# EAGLE design POV Schematic (EAGLE 8.2.1)
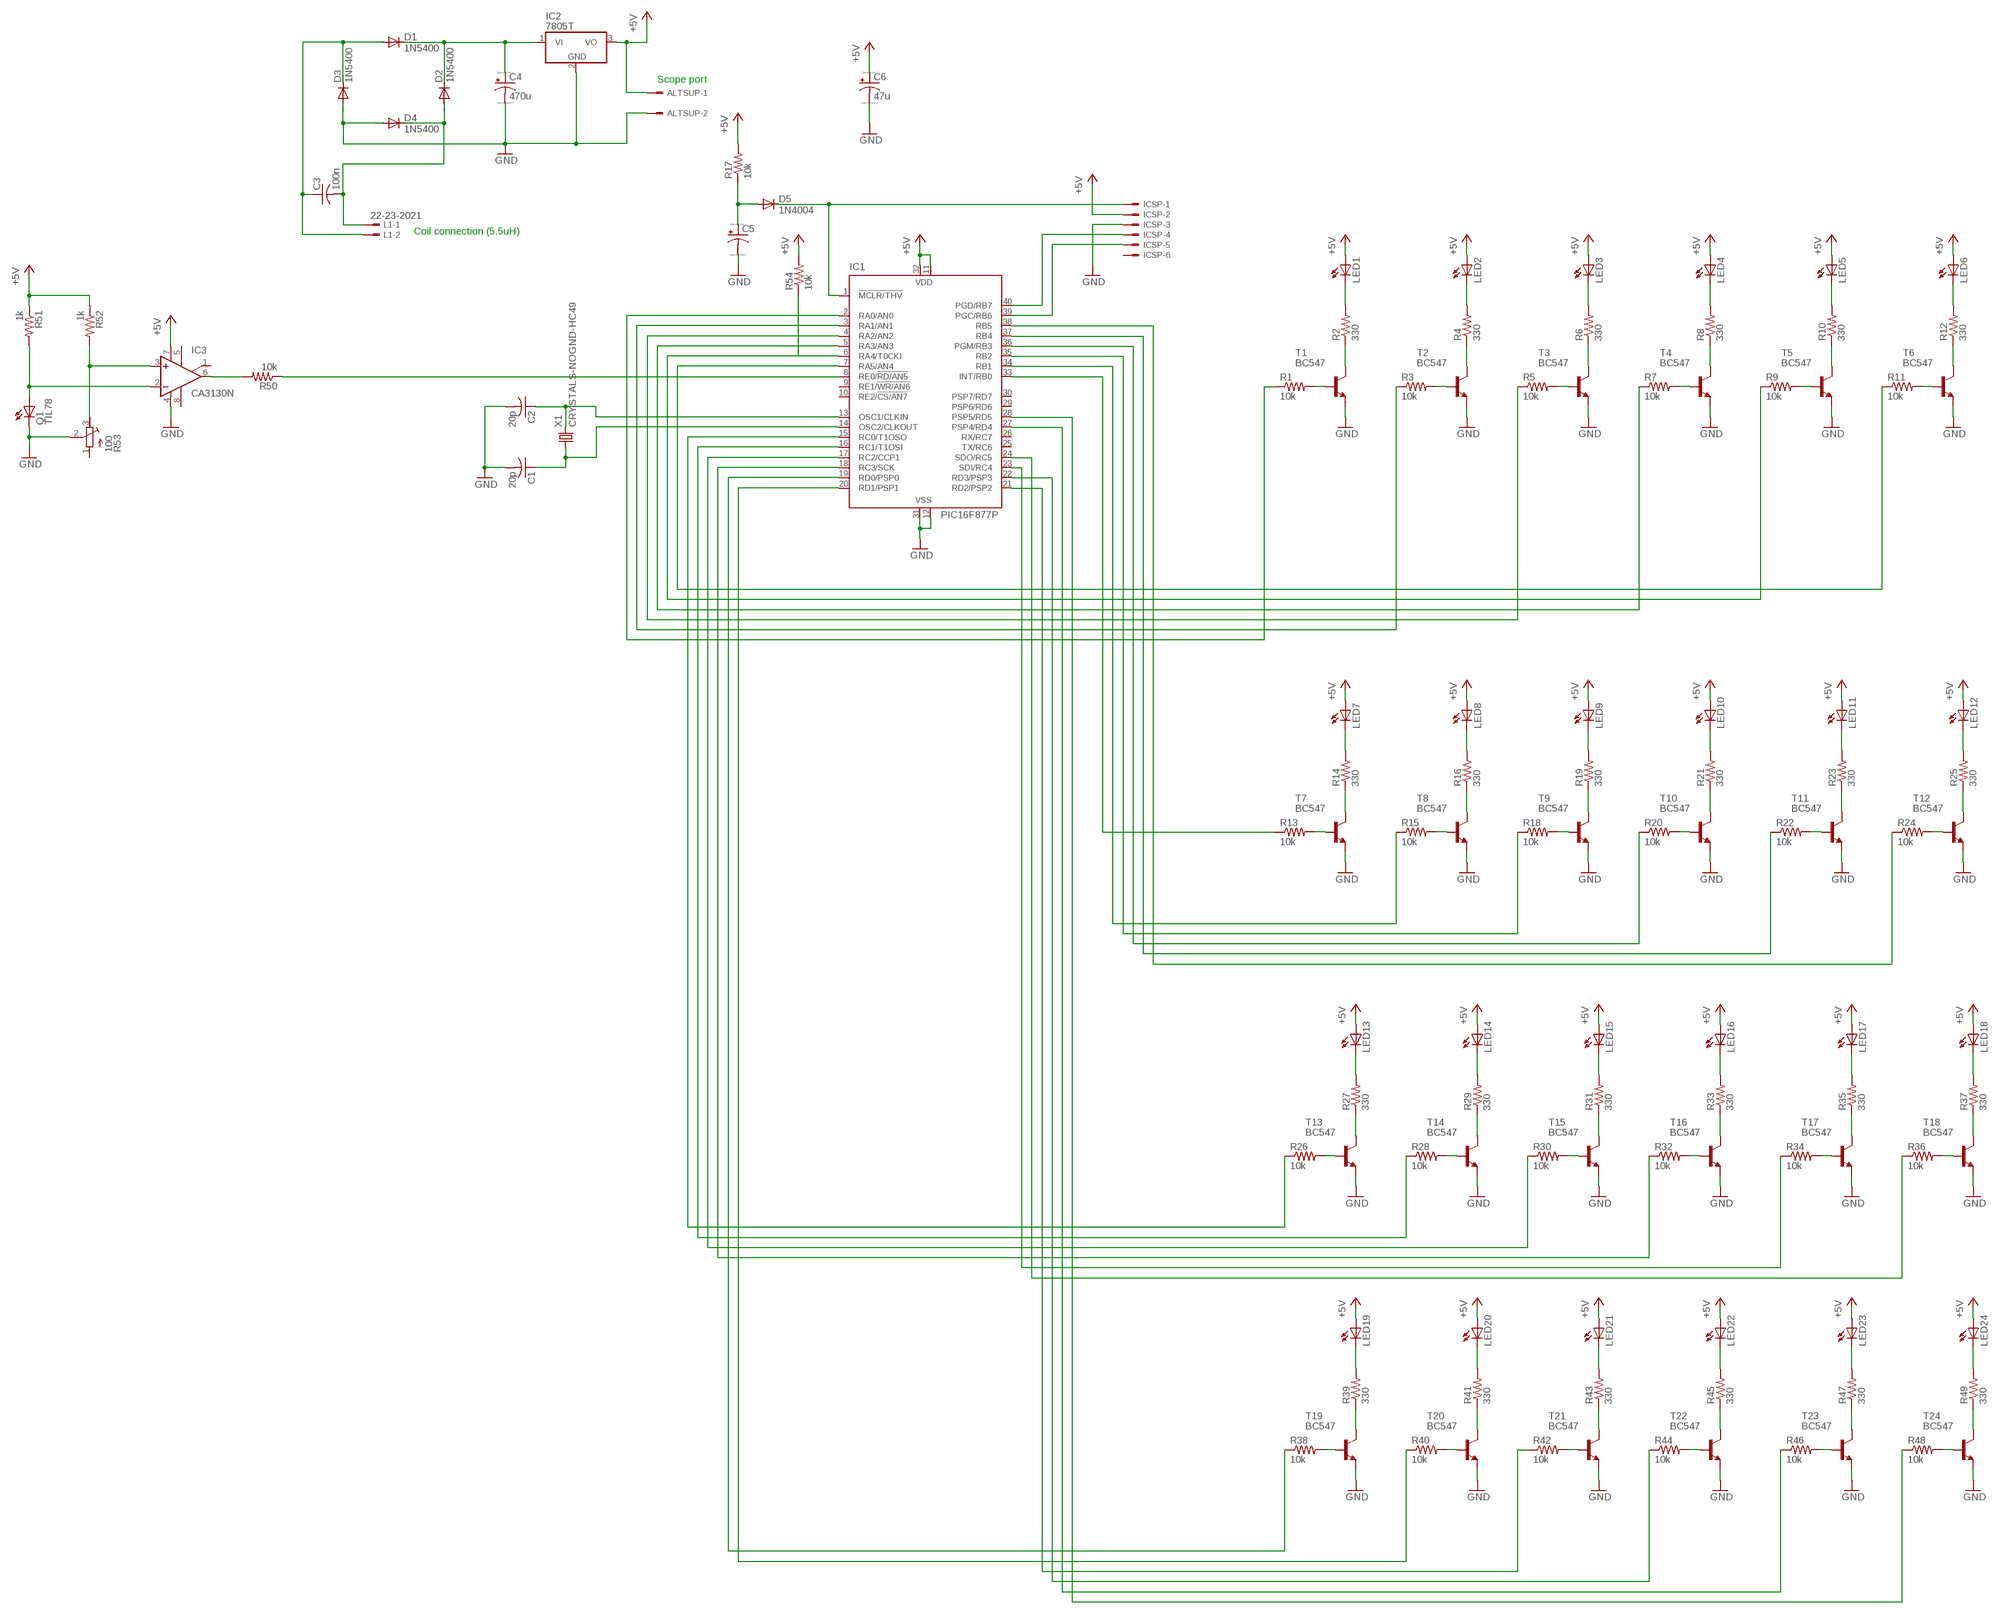
[diagram p0: schematic, sheet 1]

## Parts
ALTSUP  KK-156-2  [KK-156-2]
C1  20p  C-US025-024X044  [C025-024X044]
C2  20p  C-US025-024X044  [C025-024X044]
C3  100n  C-US050-025X075  [C050-025X075]
C4  470u  CPOL-USE3.5-8  [E3,5-8]
C5  CPOL-USE3.5-8  [E3,5-8]
C6  47u  CPOL-USE3.5-8  [E3,5-8]
D1  1N5400  [DO201-15]
D2  1N5400  [DO201-15]
D3  1N5400  [DO201-15]
D4  1N5400  [DO201-15]
D5  1N4004  [DO41-10]
IC1  PIC16F877P  [DIL40]
IC2  7805T  [TO220H]
IC3  CA3130N  [DIL08]
ICSP  KK-156-6  [KK-156-6]
L1  22-23-2021  [22-23-2021]
LED1  LED5MM  [LED5MM]
LED2  LED5MM  [LED5MM]
LED3  LED5MM  [LED5MM]
LED4  LED5MM  [LED5MM]
LED5  LED5MM  [LED5MM]
LED6  LED5MM  [LED5MM]
LED7  LED5MM  [LED5MM]
LED8  LED5MM  [LED5MM]
LED9  LED5MM  [LED5MM]
LED10  LED5MM  [LED5MM]
LED11  LED5MM  [LED5MM]
LED12  LED5MM  [LED5MM]
LED13  LED5MM  [LED5MM]
LED14  LED5MM  [LED5MM]
LED15  LED5MM  [LED5MM]
LED16  LED5MM  [LED5MM]
LED17  LED5MM  [LED5MM]
LED18  LED5MM  [LED5MM]
LED19  LED5MM  [LED5MM]
LED20  LED5MM  [LED5MM]
LED21  LED5MM  [LED5MM]
LED22  LED5MM  [LED5MM]
LED23  LED5MM  [LED5MM]
LED24  LED5MM  [LED5MM]
Q1  TIL78  LED5MM  [LED5MM]
R1  10k  R-US_0204/2V  [0204V]
R2  330  R-US_0204/2V  [0204V]
R3  10k  R-US_0204/2V  [0204V]
R4  330  R-US_0204/2V  [0204V]
R5  10k  R-US_0204/2V  [0204V]
R6  330  R-US_0204/2V  [0204V]
R7  10k  R-US_0204/2V  [0204V]
R8  330  R-US_0204/2V  [0204V]
R9  10k  R-US_0204/2V  [0204V]
R10  330  R-US_0204/2V  [0204V]
R11  10k  R-US_0204/2V  [0204V]
R12  330  R-US_0204/2V  [0204V]
R13  10k  R-US_0204/2V  [0204V]
R14  330  R-US_0204/2V  [0204V]
R15  10k  R-US_0204/2V  [0204V]
R16  330  R-US_0204/2V  [0204V]
R17  10k  R-US_0204/2V  [0204V]
R18  10k  R-US_0204/2V  [0204V]
R19  330  R-US_0204/2V  [0204V]
R20  10k  R-US_0204/2V  [0204V]
R21  330  R-US_0204/2V  [0204V]
R22  10k  R-US_0204/2V  [0204V]
R23  330  R-US_0204/2V  [0204V]
R24  10k  R-US_0204/2V  [0204V]
R25  330  R-US_0204/2V  [0204V]
R26  10k  R-US_0204/2V  [0204V]
R27  330  R-US_0204/2V  [0204V]
R28  10k  R-US_0204/2V  [0204V]
R29  330  R-US_0204/2V  [0204V]
R30  10k  R-US_0204/2V  [0204V]
R31  330  R-US_0204/2V  [0204V]
R32  10k  R-US_0204/2V  [0204V]
R33  330  R-US_0204/2V  [0204V]
R34  10k  R-US_0204/2V  [0204V]
R35  330  R-US_0204/2V  [0204V]
R36  10k  R-US_0204/2V  [0204V]
R37  330  R-US_0204/2V  [0204V]
R38  10k  R-US_0204/2V  [0204V]
R39  330  R-US_0204/2V  [0204V]
R40  10k  R-US_0204/2V  [0204V]
R41  330  R-US_0204/2V  [0204V]
R42  10k  R-US_0204/2V  [0204V]
R43  330  R-US_0204/2V  [0204V]
R44  10k  R-US_0204/2V  [0204V]
R45  330  R-US_0204/2V  [0204V]
R46  10k  R-US_0204/2V  [0204V]
R47  330  R-US_0204/2V  [0204V]
R48  10k  R-US_0204/2V  [0204V]
R49  330  R-US_0204/2V  [0204V]
R50  10k  R-US_0204/2V  [0204V]
R51  1k  R-US_0204/2V  [0204V]
R52  1k  R-US_0204/2V  [0204V]
R53  100  R-TRIMM3296W  [RTRIM3296W]
R54  10k  R-US_0204/2V  [0204V]
T1  BC547  [TO92]
T2  BC547  [TO92]
T3  BC547  [TO92]
T4  BC547  [TO92]
T5  BC547  [TO92]
T6  BC547  [TO92]
T7  BC547  [TO92]
T8  BC547  [TO92]
T9  BC547  [TO92]
T10  BC547  [TO92]
T11  BC547  [TO92]
T12  BC547  [TO92]
T13  BC547  [TO92]
T14  BC547  [TO92]
T15  BC547  [TO92]
T16  BC547  [TO92]
T17  BC547  [TO92]
T18  BC547  [TO92]
T19  BC547  [TO92]
T20  BC547  [TO92]
T21  BC547  [TO92]
T22  BC547  [TO92]
T23  BC547  [TO92]
T24  BC547  [TO92]
X1  CRYSTALS-NOGND-HC49  [HC49]

## Nets
+5V: ALTSUP.1 C6.+ IC1.11(VDD) IC1.32(VDD) IC2.3(VO) IC3.7(V+) ICSP.2 LED1.A LED2.A LED3.A LED4.A LED5.A LED6.A LED7.A LED8.A LED9.A LED10.A LED11.A LED12.A LED13.A LED14.A LED15.A LED16.A LED17.A LED18.A LED19.A LED20.A LED21.A LED22.A LED23.A LED24.A R17.2 R51.1 R52.1 R54.2
GND: ALTSUP.2 C1.2 C2.2 C4.- C5.- C6.- D3.A D4.A IC1.12(VSS) IC1.31(VSS) IC2.2(GND) IC3.4(V-) ICSP.3 Q1.K(C) R53.2(S) T1.1(E) T2.1(E) T3.1(E) T4.1(E) T5.1(E) T6.1(E) T7.1(E) T8.1(E) T9.1(E) T10.1(E) T11.1(E) T12.1(E) T13.1(E) T14.1(E) T15.1(E) T16.1(E) T17.1(E) T18.1(E) T19.1(E) T20.1(E) T21.1(E) T22.1(E) T23.1(E) T24.1(E)
N$1: C3.2 D2.A D4.C L1.1
N$2: C3.1 D1.A D3.C L1.2
N$3: D5.C IC1.1(!MCLR/THV) ICSP.1
N$4: C5.+ D5.A R17.1
N$5: C2.1 IC1.13(OSC1/CLKIN) X1.2
N$6: C4.+ D1.C D2.C IC2.1(VI)
N$7: C1.1 IC1.14(OSC2/CLKOUT) X1.1
N$8: R2.1 T1.3(C)
N$9: LED1.K(C) R2.2
N$10: R1.2 T1.2(B)
N$11: R4.1 T2.3(C)
N$12: LED2.K(C) R4.2
N$13: R3.2 T2.2(B)
N$14: R6.1 T3.3(C)
N$15: LED3.K(C) R6.2
N$16: R5.2 T3.2(B)
N$17: R8.1 T4.3(C)
N$18: LED4.K(C) R8.2
N$19: R7.2 T4.2(B)
N$20: R10.1 T5.3(C)
N$21: LED5.K(C) R10.2
N$22: R9.2 T5.2(B)
N$23: R12.1 T6.3(C)
N$24: LED6.K(C) R12.2
N$25: R11.2 T6.2(B)
N$26: R14.1 T7.3(C)
N$27: LED7.K(C) R14.2
N$28: R13.2 T7.2(B)
N$29: R16.1 T8.3(C)
N$30: LED8.K(C) R16.2
N$31: R15.2 T8.2(B)
N$32: R39.1 T19.3(C)
N$33: IC1.40(PGD/RB7) ICSP.4
N$34: IC1.39(PGC/RB6) ICSP.5
N$35: IC1.2(RA0/AN0) R1.1
N$36: IC1.3(RA1/AN1) R3.1
N$37: IC1.4(RA2/AN2) R5.1
N$38: IC1.5(RA3/AN3) R7.1
N$39: R9.1
N$40: IC1.7(RA5/AN4) R11.1
N$41: R19.1 T9.3(C)
N$42: LED9.K(C) R19.2
N$43: R18.2 T9.2(B)
N$44: R21.1 T10.3(C)
N$45: LED10.K(C) R21.2
N$46: R20.2 T10.2(B)
N$47: R23.1 T11.3(C)
N$48: LED11.K(C) R23.2
N$49: R22.2 T11.2(B)
N$50: R25.1 T12.3(C)
N$51: LED12.K(C) R25.2
N$52: R24.2 T12.2(B)
N$53: IC1.33(INT/RB0) R13.1
N$54: IC1.34(RB1) R15.1
N$55: IC1.35(RB2) R18.1
N$56: IC1.36(PGM/RB3) R20.1
N$57: IC1.37(RB4) R22.1
N$58: IC1.38(RB5) R24.1
N$59: R27.1 T13.3(C)
N$60: LED13.K(C) R27.2
N$61: R26.2 T13.2(B)
N$62: R29.1 T14.3(C)
N$63: LED14.K(C) R29.2
N$64: R28.2 T14.2(B)
N$65: R31.1 T15.3(C)
N$66: LED15.K(C) R31.2
N$67: R30.2 T15.2(B)
N$68: R33.1 T16.3(C)
N$69: LED16.K(C) R33.2
N$70: R32.2 T16.2(B)
N$71: R35.1 T17.3(C)
N$72: LED17.K(C) R35.2
N$73: R34.2 T17.2(B)
N$74: R37.1 T18.3(C)
N$75: LED18.K(C) R37.2
N$76: R36.2 T18.2(B)
N$77: LED19.K(C) R39.2
N$78: R38.2 T19.2(B)
N$79: R41.1 T20.3(C)
N$80: LED20.K(C) R41.2
N$81: R40.2 T20.2(B)
N$82: R43.1 T21.3(C)
N$83: LED21.K(C) R43.2
N$84: R42.2 T21.2(B)
N$85: R45.1 T22.3(C)
N$86: LED22.K(C) R45.2
N$87: R44.2 T22.2(B)
N$88: R47.1 T23.3(C)
N$89: LED23.K(C) R47.2
N$90: R46.2 T23.2(B)
N$91: R49.1 T24.3(C)
N$92: LED24.K(C) R49.2
N$93: R48.2 T24.2(B)
N$94: IC1.15(RC0/T1OSO) R26.1
N$95: IC1.16(RC1/T1OSI) R28.1
N$96: IC1.17(RC2/CCP1) R30.1
N$97: IC1.18(RC3/SCK) R32.1
N$98: IC1.23(SDI/RC4) R34.1
N$99: IC1.24(SDO/RC5) R36.1
N$100: IC1.19(RD0/PSP0) R38.1
N$101: IC1.20(RD1/PSP1) R40.1
N$102: IC1.21(RD2/PSP2) R42.1
N$103: IC1.22(RD3/PSP3) R44.1
N$104: IC1.27(PSP4/RD4) R46.1
N$105: IC1.28(PSP5/RD5) R48.1
N$106: IC3.2(-IN) Q1.A R51.2
N$107: IC3.6(OUT) R50.2
N$108: IC1.8(RE0/!RD/AN5) R50.1
N$109: IC3.3(+IN) R52.2 R53.3(E)
N$110: IC1.6(RA4/T0CKI) R54.1
Unconnected: IC1.9(RE1/!WR/AN6) IC1.10(RE2/!CS/AN7) IC1.25(TX/RC6) IC1.26(RX/RC7) IC1.29(PSP6/RD6) IC1.30(PSP7/RD7) IC3.1(ON/CMP) IC3.5(ON) IC3.8(CMP) ICSP.6 R53.1(A)

## Notes on the sheet
- Scope port
- Coil connection (5.5uH)

## Library data of the parts
ALTSUP = con-molex:KK-156-2: KK 156 HEADER Source: http://www.molex.com/pdm_docs/sd/026604100_sd.pdf; OC_FARNELL: unknown; OC_NEWARK: unknown
C1 C2 = resistor:C-US: CAPACITOR, American symbol
C3 = rcl:C-US: CAPACITOR, American symbol
C4-C6 = resistor:CPOL-US: POLARIZED CAPACITOR, American symbol
D1-D4 = diode:1N5400: DIODE standard rectifier, 3 A, 50 V (Motorola)
D5 = diode:1N4004: DIODE general purpose rectifier, 1 A
IC1 = microchip:PIC16F87*: MICROCONTROLLER; MF: MICROCHIP; MPN: PIC16F877-04/P; OC_FARNELL: 9761349; OC_NEWARK: 61K3463
IC2 = linear:78*: Positive VOLTAGE REGULATOR Source: http://cache.national.com/ds/LM/LM78L05.pdf http://www.fairchildsemi.com/ds/LM/LM7805.pdf
IC3 = linear:CA3130: OP AMP
ICSP = con-molex:KK-156-6: KK 156 HEADER Source: http://www.molex.com/pdm_docs/sd/026604100_sd.pdf; OC_FARNELL: unknown; OC_NEWARK: unknown
L1 = con-molex:22-23-2021: .100" (2.54mm) Center Header - 2 Pin; MF: MOLEX; MPN: 22-23-2021; OC_FARNELL: 1462926; OC_NEWARK: 25C3832
LED1-LED24 Q1 = led:LED: LED OSRAM: - CHIPLED LG R971, LG N971, LY N971, LG Q971, LY Q971, LO R971, LY R971 LH N974, LH R974 LS Q976, LO Q976, LY Q976 LO Q996 - Hyper CHIPLED LW Q18S LB Q993, LB Q99A, LB R99A - SideLED LS A670, LO A670, LY A670, LG A670, LP A670 LB A673, LV A673, LT A673, LW A673 LH A674 LY A675 LS A676, LA A676, LO A676, LY A676, LW A676 LS A679, LY A679, LG A679 - Hyper Micro SIDELED® LS Y876, LA Y876, LO Y876, LY Y876 LT Y87S - SmartLED LW L88C, LW L88S LB L89C, LB L89S, LG L890 LS L89K, LO L89K, LY L89K LS L896, LA L896, LO L896, LY L896 - TOPLED LS T670, LO T670, LY T670, LG T670, LP T670 LSG T670, LSP T670, LSY T670, LOP T670, LYG T670 LG T671, LOG T671, LSG T671 LB T673, LV T673, LT T673, LW T673 LH T674 LS T676, LA T676, LO T676, LY T676, LB T676, LH T676, LSB T676, LW T676 LB T67C, LV T67C, LT T67C, LS T67K, LO T67K, LY T67K, LW E67C LS E67B, LA E67B, LO E67B, LY E67B, LB E67C, LV E67C, LT E67C LW T67C LS T679, LY T679, LG T679 LS T770, LO T770, LY T770, LG T770, LP T770 LB T773, LV T773, LT T773, LW T773 LH T774 LS E675, LA E675, LY E675, LS T675 LS T776, LA T776, LO T776, LY T776, LB T776 LHGB T686 LT T68C, LB T68C - Hyper Mini TOPLED® LB M676 - Mini TOPLED Santana® LG M470 LS M47K, LO M47K, LY M47K Source: http://www.osram.convergy.de LUXEON: - LUMILED® LXK2-PW12-R00, LXK2-PW12-S00, LXK2-PW14-U00, LXK2-PW14-V00 LXK2-PM12-R00, LXK2-PM12-S00, LXK2-PM14-U00 LXK2-PE12-Q00, LXK2-PE12-R00, LXK2-PE12-S00, LXK2-PE14-T00, LXK2-PE14-U00 LXK2-PB12-K00, LXK2-PB12-L00, LXK2-PB12-M00, LXK2-PB14-N00, LXK2-PB14-P00, LXK2-PB14-Q00 LXK2-PR12-L00, LXK2-PR12-M00, LXK2-PR14-Q00, LXK2-PR14-R00 LXK2-PD12-Q00, LXK2-PD12-R00, LXK2-PD12-S00 LXK2-PH12-R00, LXK2-PH12-S00 LXK2-PL12-P00, LXK2-PL12-Q00, LXK2-PL12-R00 Source: www.luxeon.com KINGBRIGHT: KA-3528ASYC Source: www.kingbright.com
R1-R52 R54 = resistor:R-US_: RESISTOR, American symbol
R53 = rcl:R-TRIMM: Trimm resistor
T1-T24 = transistor:BC547: NPN TRANSISTOR
X1 = IQD-Frequency-Products:CRYSTALS-NOGND: CRYSTALS CAN NOT GROUNDED

## Net classes
0 default: width 0.254 mm

## Board
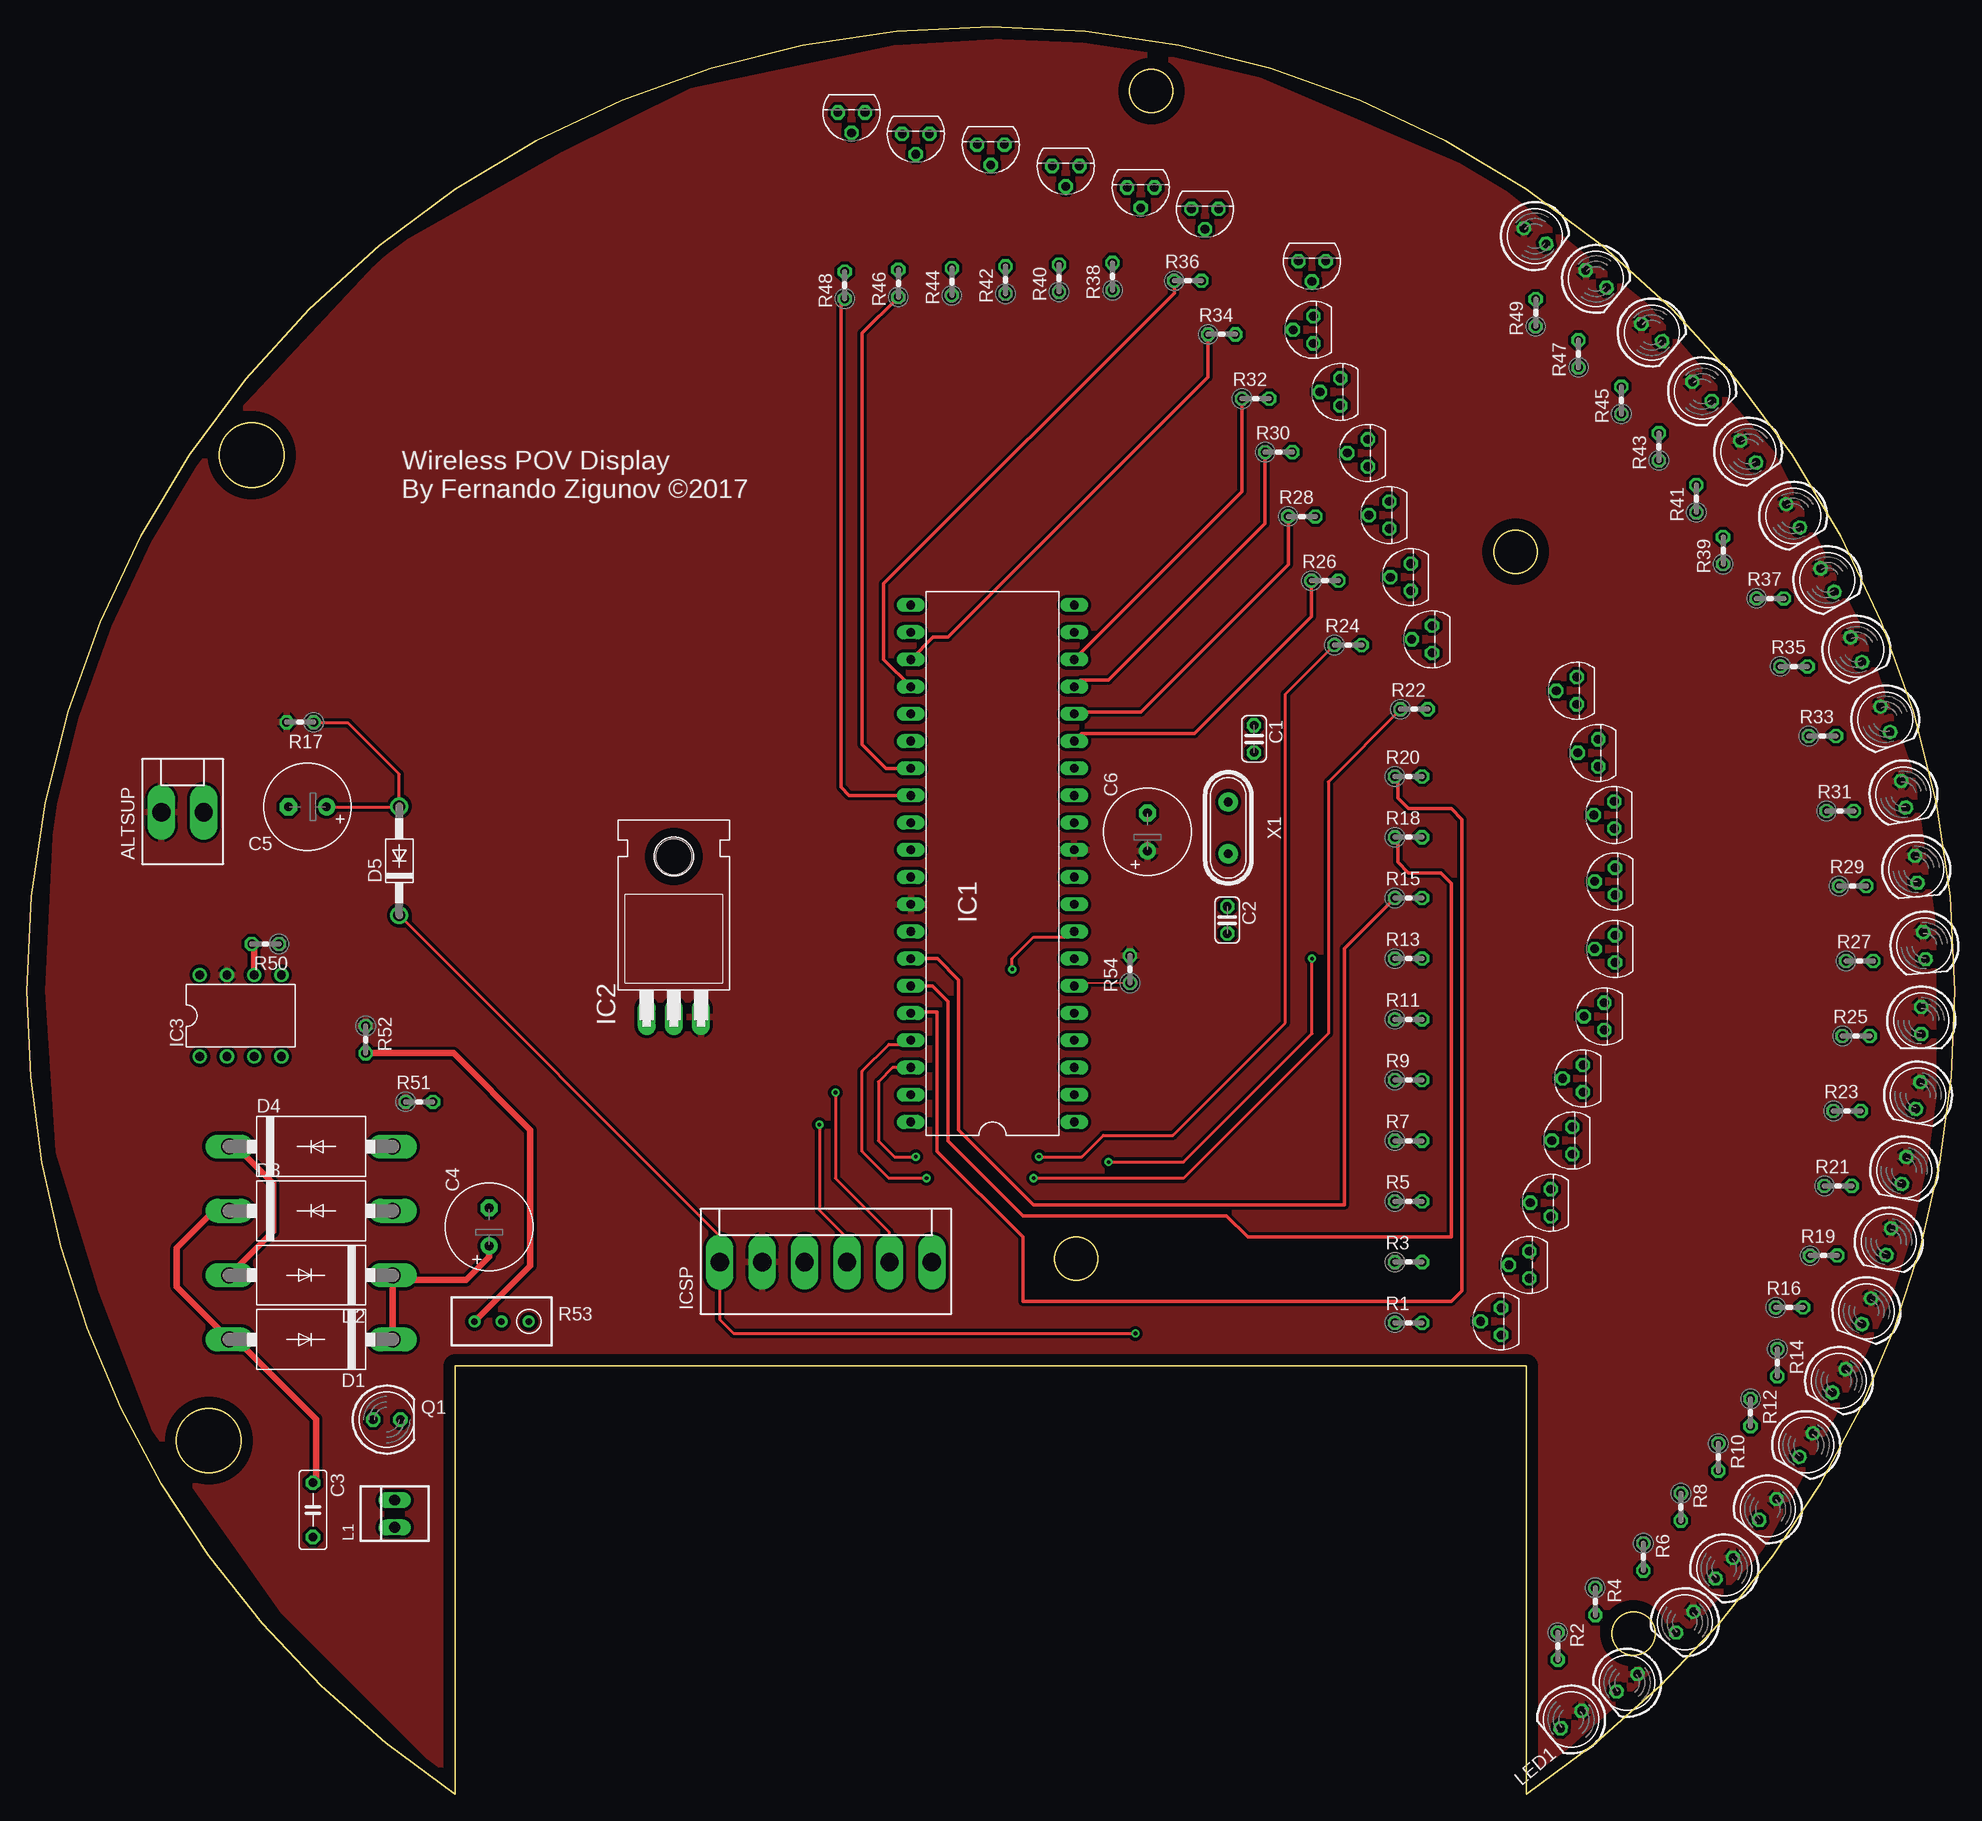
[diagram p1: board, top side]
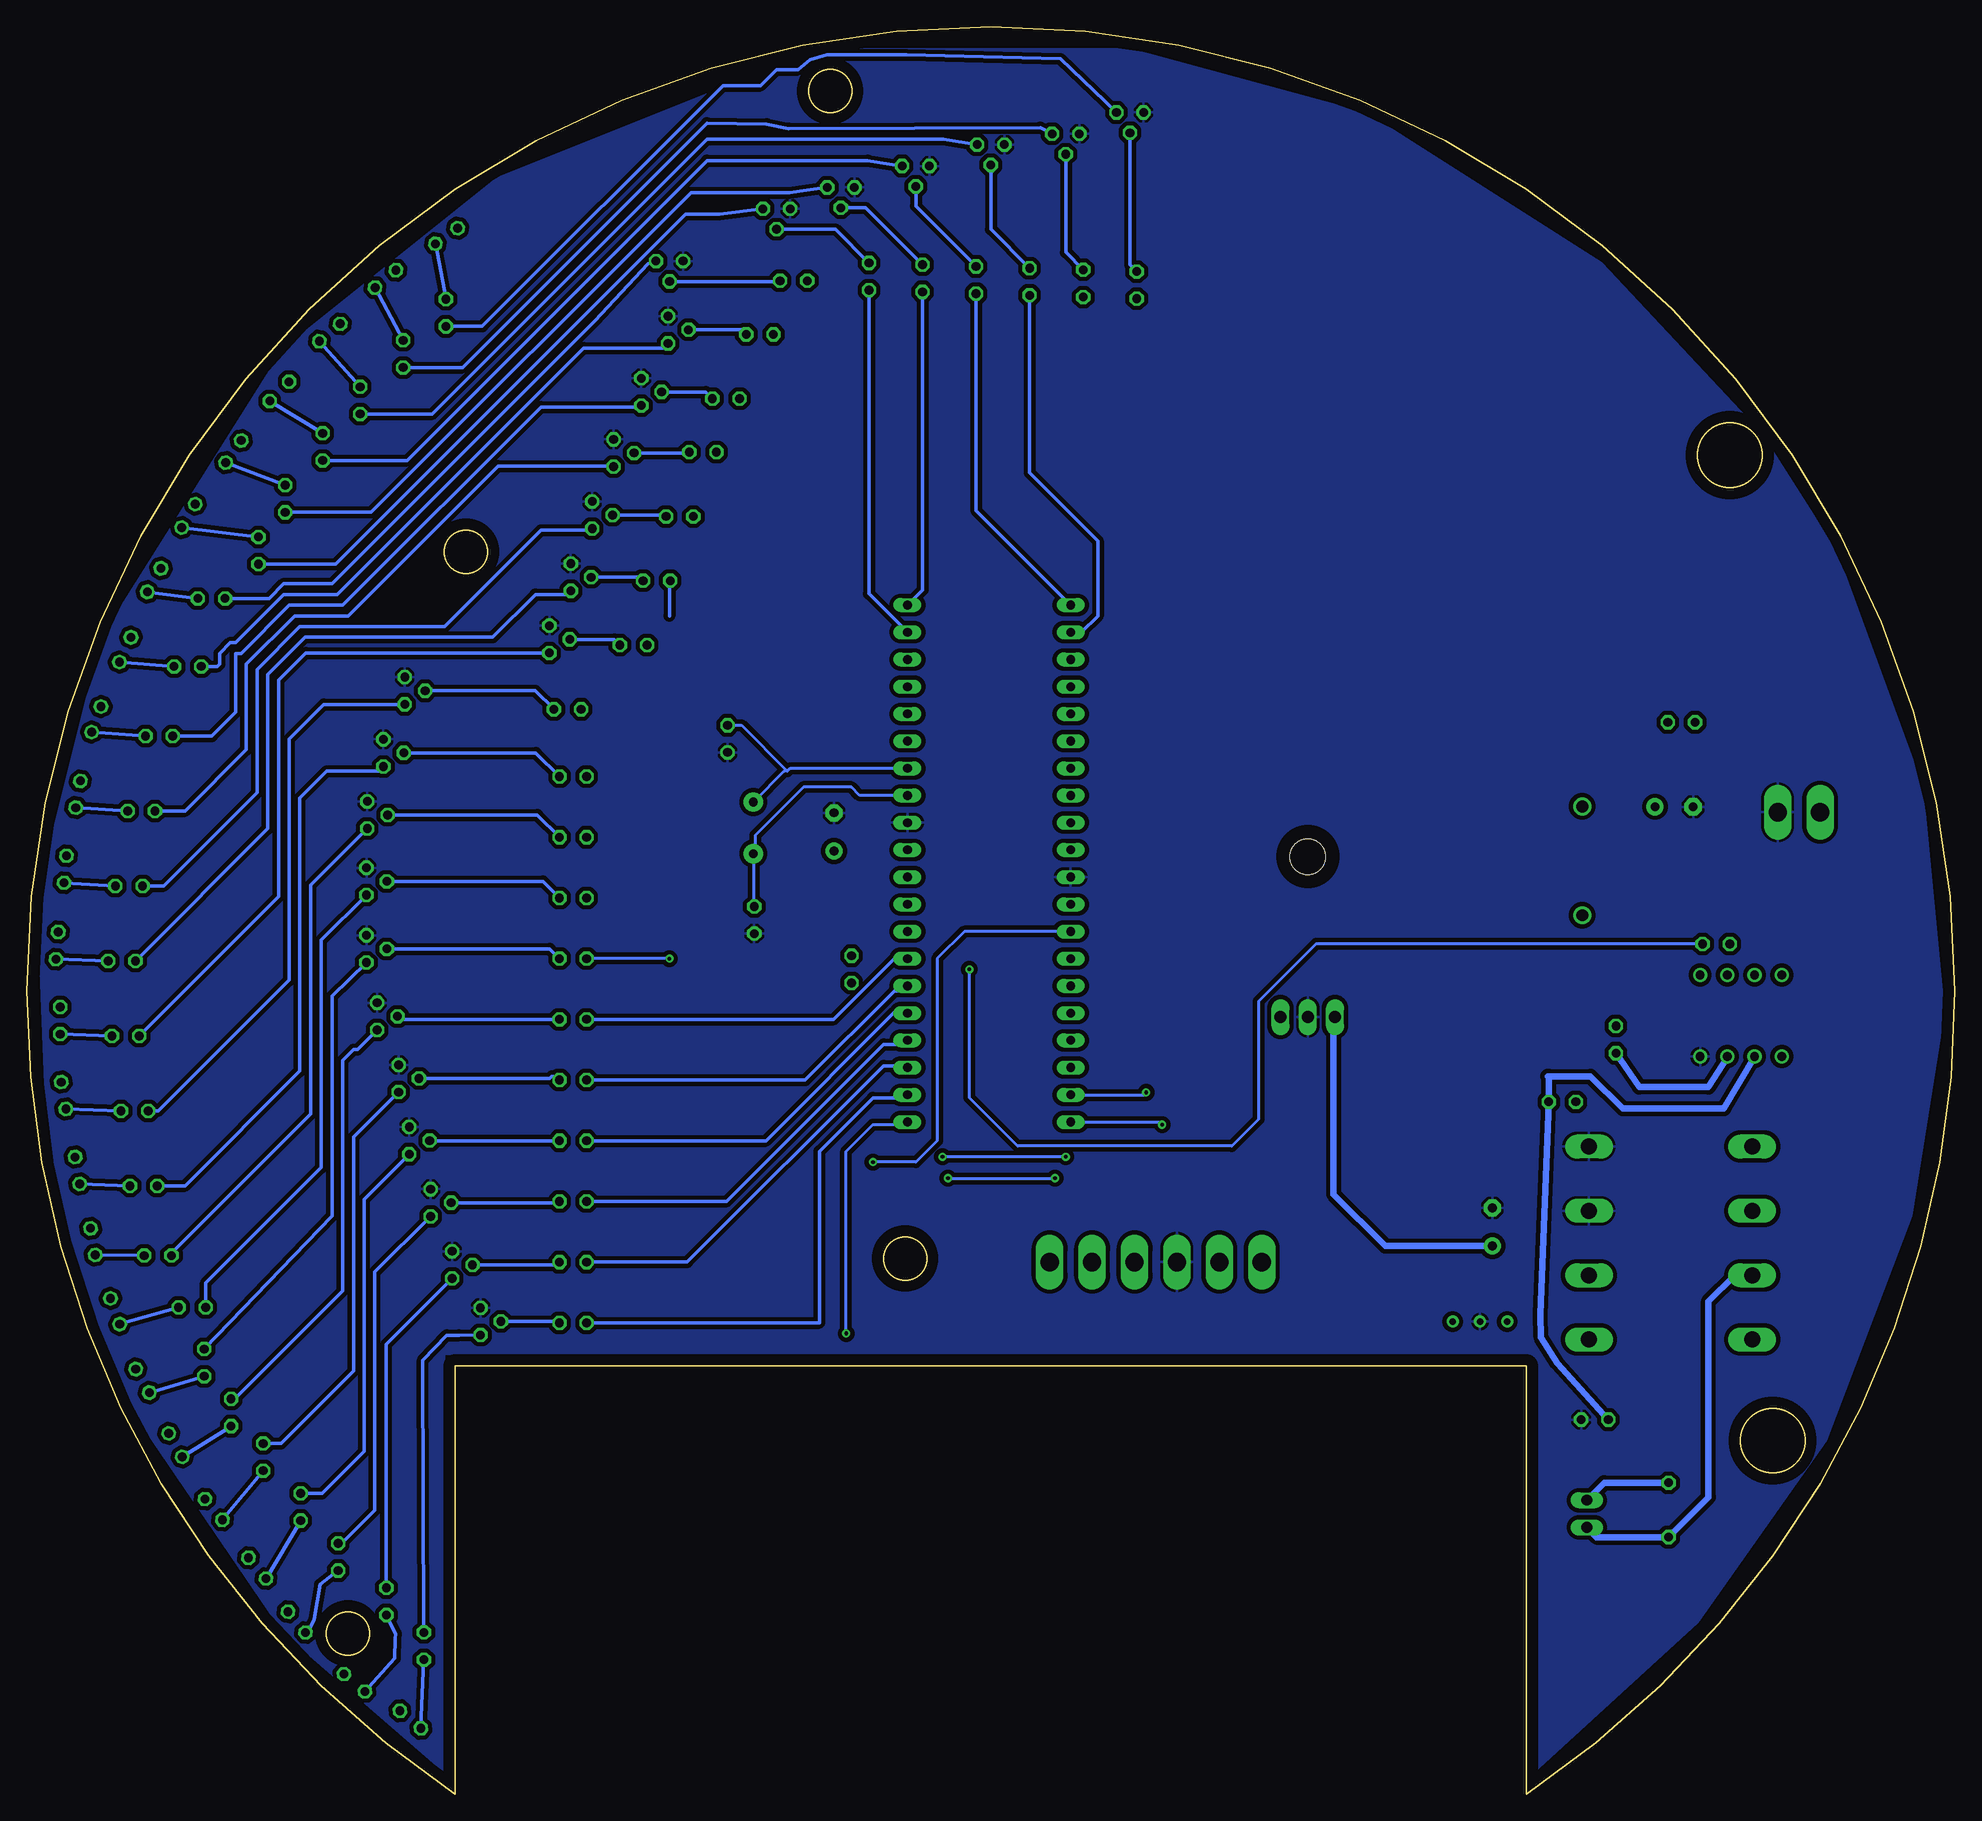
[diagram p2: board, bottom side, seen from below]

Size 180 x 165 mm. Coordinates in mm from the lower left corner, seen from the top.
Outline: 140,40 140,0 arc56 180,75 arc180 0,75 arc56 40,0 40,40 140,40
Outline: circle at 17,33 radius 3
Outline: circle at 21,125 radius 3
Outline: circle at 98,50 radius 2
Outline: circle at 150,15 radius 2
Outline: circle at 139,116 radius 2
Outline: circle at 105,159 radius 2
Copper layers (1*16): Top 0.035mm / dielectric 1.5mm / Bottom 0.035mm
Design rules "default *": minimum track width 6mil, minimum drill 0.35mm, track to track 6mil, track to pad 6mil, pad to pad 6mil, via to via 6mil, smd to smd 6mil, copper to edge 40mil, drill to drill 10mil, minimum pad ring 10mil, minimum via ring 8mil, stop-mask expansion 4mil, vias tented up to drill 0mil, thermal gap 10mil

### Footprints (pad centres in the part's own frame; a part is rotated, then mirrored left to right if it is on the bottom)
KK-156-2 = drill 1.7 pad 2.184 long: 1 -1.98,0; 2 1.98,0
C025-024X044 = drill 0.813 octagon: 1 -1.27,0; 2 1.27,0
C050-025X075 = drill 0.813 octagon: 1 -2.54,0; 2 2.54,0
E3,5-8 = drill 0.813 pad 1.6: + -1.778,0 | drill 0.813 pad 1.6 octagon: - 1.778,0
DO201-15 = drill 1.499 long: A 7.62,0; C -7.62,0
DO41-10 = drill 1.118: A 5.08,0; C -5.08,0
DIL40 = drill 0.813 long: 1 -24.13,-7.62; 2 -21.59,-7.62; 3 -19.05,-7.62; 4 -16.51,-7.62; 5 -13.97,-7.62; 6 -11.43,-7.62; 7 -8.89,-7.62; 8 -6.35,-7.62; 9 -3.81,-7.62; 10 -1.27,-7.62; 11 1.27,-7.62; 12 3.81,-7.62; 13 6.35,-7.62; 14 8.89,-7.62; 15 11.43,-7.62; 16 13.97,-7.62; 17 16.51,-7.62; 18 19.05,-7.62; 19 21.59,-7.62; 20 24.13,-7.62; 21 24.13,7.62; 22 21.59,7.62; 23 19.05,7.62; 24 16.51,7.62; 25 13.97,7.62; 26 11.43,7.62; 27 8.89,7.62; 28 6.35,7.62; 29 3.81,7.62; 30 1.27,7.62; 31 -1.27,7.62; 32 -3.81,7.62; 33 -6.35,7.62; 34 -8.89,7.62; 35 -11.43,7.62; 36 -13.97,7.62; 37 -16.51,7.62; 38 -19.05,7.62; 39 -21.59,7.62; 40 -24.13,7.62
TO220H = drill 1.118 long: 1 -2.54,-10.16; 2 0,-10.16; 3 2.54,-10.16 | hole 3.302: 0,4.826
DIL08 = drill 0.813 pad 1.27: 1 -3.81,-3.81; 2 -1.27,-3.81; 3 1.27,-3.81; 4 3.81,-3.81; 5 3.81,3.81; 6 1.27,3.81; 7 -1.27,3.81; 8 -3.81,3.81
KK-156-6 = drill 1.7 pad 2.184 long: 1 -9.9,0; 2 -5.94,0; 3 -1.98,0; 4 1.98,0; 5 5.94,0; 6 9.9,0
22-23-2021 = drill 1 long: 1 -1.27,0; 2 1.27,0
LED5MM = drill 0.813 octagon: A -1.27,0; K 1.27,0
0204V = drill 0.813 octagon: 1 -1.27,0; 2 1.27,0
RTRIM3296W = drill 0.61: 1 0,-2.54; 2 0,0; 3 0,2.54
TO92 = drill 0.813 octagon: 1 1.27,0; 2 0,1.905; 3 -1.27,0
HC49 = drill 0.813 pad 1.8: 1 -2.413,0; 2 2.413,0

### Placement (x,y rotation side)
ALTSUP  14.55,91.67 0 top
C1  114.58,98.52 270 top
C2  112.08,81.6 270 top
C3  26.72,26.53 270 top
C4  43.17,52.95 90 top
C5  26.21,92.17 180 top
C6  104.63,89.83 90 top
D1  26.53,42.44 180 top
D2  26.53,48.44 180 top
D3  26.53,54.45 0 top
D4  26.53,60.45 0 top
D5  34.78,87.13 90 top
IC1  90.16,86.88 90 top
IC2  60.41,82.7 0 top
IC3  19.96,72.67 0 top
ICSP  74.6,49.67 0 top
L1  34.35,26.17 90 top
LED1  144.18,6.96 220 top
LED2  149.41,10.39 220 top
LED3  154.79,16.05 230 top
LED4  158.48,21.08 230 top
LED5  162.55,26.58 230 top
LED6  166.12,32.58 240 top
LED7  169.19,38.58 240 top
LED8  171.76,45.08 250 top
LED9  173.83,51.58 260 top
LED10  175.27,58.22 260 top
LED11  176.57,65.22 260 top
LED12  176.87,72.22 270 top
LED13  177.17,79.22 275 top
LED14  176.41,86.34 275 top
LED15  175.21,93.34 280 top
LED16  173.51,100.34 290 top
LED17  170.81,106.84 295 top
LED18  168.11,113.34 300 top
LED19  164.91,119.34 300 top
LED20  160.71,125.34 305 top
LED21  156.41,130.96 315 top
LED22  151.71,136.46 320 top
LED23  146.51,141.46 320 top
LED24  140.81,145.46 325 top
Q1  33.61,34.96 0 top
R1  129,44 0 top
R2  142.93,13.82 270 top
R3  129,49.67 0 top
R4  146.43,17.98 270 top
R5  129,55.33 0 top
R6  150.93,22.14 270 top
R7  129,61 0 top
R8  154.43,26.8 270 top
R9  129,66.67 0 top
R10  157.93,31.46 270 top
R11  129,72.33 0 top
R12  160.93,35.62 270 top
R13  129,78 0 top
R14  163.43,40.28 270 top
R15  129,83.67 0 top
R16  164.56,45.43 0 top
R17  25.52,100.07 180 top
R18  129,89.33 0 top
R19  167.76,50.28 0 top
R20  129,95 0 top
R21  169.1,56.78 0 top
R22  129.52,101.28 0 top
R23  169.94,63.78 0 top
R24  123.36,107.28 0 top
R25  170.78,70.78 0 top
R26  121.2,113.28 0 top
R27  171.12,77.78 0 top
R28  119.04,119.28 0 top
R29  170.46,84.78 0 top
R30  116.88,125.28 0 top
R31  169.3,91.78 0 top
R32  114.72,130.28 0 top
R33  167.64,98.78 0 top
R34  111.56,136.28 0 top
R35  164.98,105.28 0 top
R36  108.4,141.28 0 top
R37  162.76,111.63 0 top
R38  101.37,141.68 90 top
R39  158.37,116.1 90 top
R40  96.37,141.52 90 top
R41  155.87,120.94 90 top
R42  91.37,141.36 90 top
R43  152.37,125.78 90 top
R44  86.37,141.2 90 top
R45  148.87,130.12 90 top
R46  81.37,141.04 90 top
R47  144.87,134.46 90 top
R48  76.37,140.88 90 top
R49  140.87,138.3 90 top
R50  22.28,79.37 180 top
R51  36.64,64.63 0 top
R52  31.63,70.44 270 top
R53  44.33,44.12 90 top
R54  103,77 90 top
T1  137.64,44.13 90 top
T2  140.29,49.41 90 top
T3  142.29,55.21 90 top
T4  144.29,61.01 90 top
T5  145.29,66.81 90 top
T6  147.29,72.61 90 top
T7  148.29,78.91 90 top
T8  148.29,85.21 90 top
T9  148.21,91.41 90 top
T10  146.71,97.21 90 top
T11  144.71,103.01 90 top
T12  131.21,107.81 90 top
T13  129.21,113.61 90 top
T14  127.21,119.41 90 top
T15  125.21,125.21 90 top
T16  122.63,130.91 90 top
T17  120.13,136.71 90 top
T18  119.99,143.13 180 top
T19  110,148 180 top
T20  104,150 180 top
T21  97,152 180 top
T22  90,154 180 top
T23  83,155 180 top
T24  77,157 180 top
X1  112.17,90.21 270 top

### Tracks (layer width: path | path; a pad name or v marks a point on that pad's centre or on a via)
+5V
  pour Top (isolate 0.3): 39,2 39,41 141,41 141,2 150,10 162,23 170,38 176,51 178,64 178,81 176,95 171,109 163,125 151,139 136,151 115,160 98,164 81,163 62,159 50,153 34,144 20,129 11,117 3,95 2,75 3,60 7,47 12,34 24,17
GND
  Top 0.305: 140.5,50 140.5,50.47 T2.1 | T8.1 148.29,86.79 | T17.1 120.02,137.98 | 118.5,142.91 T18.1 | T20.1 102.73,150.27 | T21.1 95.73,152.27
  pour Bottom (isolate 0.4): 39.4,1.9 39.77,40.21 141,41 141,2 156,15 171,37 178,58 179,84 173,108 156,135 136,151 106,163 77,163 55,157 33,143 18,127 11,116 3,94 1,73 4,54 12,33 24,16
N$1
  Top 0.61: D2.A 23,52.53 23,57 19.55,60.45 D4.C
  Bottom 0.305: 20.56,48.44 D2.A
  Bottom 0.61: L1.1 33.44,23.99 C3.2 23,27.71 23,46 20.56,48.44
N$2
  Top 0.61: C3.1 27,29.35 27,35 19.56,42.44 D1.A 14,47.36 14,51 17.45,54.45 D3.C
  Bottom 0.61: L1.2 32.72,29.07 C3.1
N$3  (via drill 0.35)
  Top 0.3: D5.C 64.7,52.13 ICSP.1 64.7,44.3 66,43 v103.5,43
  Bottom 0.3: v103.5,43 103.5,60 101,62.5 98.03,62.5 IC1.1
N$4
  Top 0.3: 34.78,92.5 D5.A | 34.78,92.5 34.78,95.22 30,100 26.86,100 R17.1 | C5.+ 34.45,92.17 34.78,92.5
N$5
  Bottom 0.3: IC1.13 102.23,93.23 103,94 107.5,94 112,89.5 112,87.97 X1.2 112.17,82.96 C2.1
N$6
  Top 0.61: D1.C D2.C 34.6,48 41,48 43.17,50.17 C4.+
  Bottom 0.61: IC2.1 58,72.41 58,56 53.17,51.17 C4.+
N$7
  Bottom 0.3: IC1.14 108.73,95.77 109,95.5 | 109,95.5 109.29,95.5 X1.1 | C1.1 113.29,99.79 109,95.5
N$8
  Bottom 0.305: T1.3 139.64,42.83 140.79,42.83 143.03,40.5 R2.1
N$9
  Bottom 0.305: R2.2 LED1.K
N$10
  Bottom 0.305: T1.2 130.4,44.13 R1.2
N$11
  Bottom 0.305: R4.1 146.43,42 T2.3
N$12
  Bottom 0.305: R4.2 145.56,14.98 145.6,14.52 145.65,12.67 LED2.K
N$13
  Bottom 0.305: T2.2 130.53,49.41 R3.2
N$14
  Bottom 0.305: R6.1 150.59,23.41 147.5,26.5 147.5,48.73 T3.3
N$15
  Bottom 0.305: R6.2 152.63,19.58 153.17,16.31 153.6,15.41 LED3.K
N$16
  Bottom 0.305: T3.2 130.39,55.21 R5.2
N$17
  Bottom 0.305: R8.1 152.43,28.07 148.5,32 148.5,55.53 T4.3
N$18
  Bottom 0.305: R8.2 LED4.K
N$19
  Bottom 0.305: R7.2 T4.2
N$20
  Bottom 0.305: R10.1 156.27,32.73 149.5,39.5 149.5,61.33 T5.3
N$21
  Bottom 0.305: R10.2 LED5.K
N$22
  Bottom 0.305: T5.2 131.19,66.81 131,67 130.6,67 R9.2
N$23
  Bottom 0.305: R12.1 160.61,36.89 150.5,47 150.5,68.5 149.5,69.5 149.13,69.5 T6.3
N$24
  Bottom 0.305: R12.2 LED6.K
N$25
  Bottom 0.305: R11.2 145.11,72.33 T6.2
N$26
  Bottom 0.305: R14.1 151.5,54 151.5,74.5 T7.3
N$27
  Bottom 0.305: R14.2 LED7.K
N$28
  Bottom 0.305: T7.2 131.18,78.91 R13.2
N$29
  Bottom 0.305: R16.1 163.29,47.71 152.5,58.5 152.5,79.73 T8.3
N$30
  Bottom 0.305: R16.2 LED8.K
N$31
  Bottom 0.305: T8.2 131.81,85.21 R15.2
N$32
  Bottom 0.305: R39.1 151.17,114.83 118.5,147.5 115.33,147.5 T19.3
N$33  (via drill 0.35)
  Top 0.3: v74,62.5 74,54.5 76.5,52 76.5,49.75 ICSP.4
  Bottom 0.3: IC1.40 74.25,62.75 v74,62.5
N$34  (via drill 0.35)
  Top 0.3: v75.5,65.5 75.5,57.5 80.5,52.5 80.5,49.71 ICSP.5
  Bottom 0.3: IC1.39 75.71,65.29 v75.5,65.5
N$35
  Bottom 0.305: R1.1 106,44 106,60 101,65 98.07,65 IC1.2
N$36
  Bottom 0.305: R3.1 118.33,49.67 100,68 97.95,68 IC1.3
N$37
  Bottom 0.305: R5.1 114.67,55.33 100,70 98.15,70 IC1.4
N$38
  Bottom 0.305: R7.1 111,61 99,73 97.87,73 IC1.5
N$39
  Bottom 0.305: R9.1 107.33,66.67 99,75 98.23,75
N$40
  Bottom 0.305: R11.1 104.67,72.33 99,78 IC1.7
N$41
  Bottom 0.305: R19.1 166.49,50.51 153.5,63.5 153.5,84.85 T9.3
N$42
  Bottom 0.305: R19.2 LED9.K
N$43
  Bottom 0.305: T9.2 132.35,91.41 R18.2
N$44
  Bottom 0.305: R21.1 165.22,56.78 154.5,67.5 154.5,93 152,95.5 147,95.5 147,95.65 T10.3
N$45
  Bottom 0.305: R21.2 LED10.K
N$46
  Bottom 0.305: T10.2 132.48,97.21 R20.2
N$47
  Bottom 0.305: R23.1 167.72,63.78 155.5,76 155.5,98.5 152.26,101.74 T11.3
N$48
  Bottom 0.305: R23.2 LED11.K
N$49
  Bottom 0.305: T11.2 132.52,103.01 R22.2
N$50
  Bottom 0.305: R25.1 156.5,83.79 156.5,104 153.96,106.54 T12.3
N$51
  Bottom 0.305: R25.2 LED12.K
N$52
  Bottom 0.305: T12.2 125.16,107.81 R24.2
N$53  (via drill 0.35)
  Top 0.3: v101,59 108,59 120,71 v120,78
  Bottom 0.3: IC1.33 92.47,80.53 95,78 95,61 97,59 v101,59 | v120,78 R13.1 | R13.1
N$54
  Top 0.305: R15.1 123,78.94 123,55 94,55 87,62 87,76 85.01,77.99 IC1.34
N$55
  Top 0.305: R18.1 128,89.06 128,87 129,86 132,86 133,85 133,52 114,52 112,54 93,54 86,61 86,74 84.55,75.45 IC1.35
N$56
  Top 0.305: R20.1 128,94.73 128,93 129,92 133,92 134,91 134,47 133,46 93,46 93,52 85,60 85,73 83,73 83,72.91 IC1.36
N$57  (via drill 0.35)
  Top 0.3: R22.1 128.25,101.25 121.5,94.5 121.5,71 108,57.5 v94,57.5 | v84,57.5 80.5,57.5 78,60 78,67.5 80.5,70 82.17,70 IC1.37
  Bottom 0.3: v94,57.5 v84,57.5
N$58  (via drill 0.35)
  Top 0.3: IC1.38 80.83,67.83 79.5,66.5 79.5,61 81,59.5 v83,59.5 | v94.5,59.5 98.5,59.5 100.5,61.5 107,61.5 117.5,72 117.5,102.69 R24.1
  Bottom 0.3: v83,59.5 v94.5,59.5
N$59
  Bottom 0.305: R27.1 157.5,90.13 157.5,104.5 154,108 136.5,108 132.5,112 129.55,112 T13.3
N$60
  Bottom 0.305: R27.2 LED13.K
N$61
  Bottom 0.305: T13.2 122.8,113.61 R26.2
N$62
  Bottom 0.305: R29.1 167.22,84.78 158.5,93.5 158.5,105 154.5,109 141,109 132,118 127.35,118 T14.3
N$63
  Bottom 0.305: R29.2 LED14.K
N$64
  Bottom 0.305: T14.2 120.44,119.41 R28.2
N$65
  Bottom 0.305: R31.1 165.22,91.78 159.5,97.5 159.5,105.5 155,110 150,110 136,124 125.27,124 T15.3
N$66
  Bottom 0.305: R31.2 LED15.K
N$67
  Bottom 0.305: T15.2 118.22,125.21 R30.2
N$68
  Bottom 0.305: R33.1 162.72,98.78 160.5,101 160.5,106.5 160,106.5 155.5,111 150.5,111 132,129.5 122.77,129.5 T16.3
N$69
  Bottom 0.305: R33.2 LED16.K
N$70
  Bottom 0.305: T16.2 116.62,130.91 R32.2
N$71
  Bottom 0.305: R35.1 162.22,105.28 162,105.5 162,106.5 161,107.5 160.5,107.5 156,112 151,112 128,135 120.57,135 T17.3
N$72
  Bottom 0.305: R35.2 LED17.K
N$73
  Bottom 0.305: T17.2 113.26,136.71 R34.2
N$74
  Bottom 0.305: R37.1 157.37,111.63 156,113 151.5,113 127,137.5 122,142.89 T18.3
N$75
  Bottom 0.305: R37.2 LED18.K
N$76
  Bottom 0.305: T18.2 109.72,141.22 R36.2
N$77
  Bottom 0.305: R39.2 LED19.K
N$78
  Bottom 0.305: T19.2 104.52,146.09 R38.2
N$79
  Bottom 0.305: R41.1 147.83,119.67 118,149.5 108.79,149.5 T20.3
N$80
  Bottom 0.305: R41.2 LED20.K
N$81
  Bottom 0.305: T20.2 101.67,148.09 R40.2
N$82
  Bottom 0.305: R43.1 144.49,124.51 116.5,152.5 101.49,152.5 T21.3
N$83
  Bottom 0.305: R43.2 LED21.K
N$84
  Bottom 0.305: T21.2 97,148.26 R42.2
N$85
  Bottom 0.305: R45.1 142.15,128.85 116.5,154.5 94.43,154.5 T22.3
N$86
  Bottom 0.305: R45.2 LED22.K
N$87
  Bottom 0.305: T22.2 90,146.1 R44.2
N$88
  Bottom 0.305: R47.1 139.31,133.19 116.5,156 110.92,155.9 108.86,155.49 85.36,155.58 T23.3
N$89
  Bottom 0.305: R47.2 LED23.K
N$90
  Bottom 0.305: T23.2 83,143.94 R46.2
N$91
  Bottom 0.305: R49.1 137.47,137.03 115,159.5 111.5,159.5 110,161 108,161 106.86,161.94 105.26,162.41 97.87,162.37 83.5,162 T24.3
N$92
  Bottom 0.305: R49.2 LED24.K
N$93
  Bottom 0.305: T24.2 77,142.78 R48.2
N$94
  Top 0.305: R26.1 119.93,109.93 109,99 98.47,99 IC1.15
  Bottom 0.305: R26.1 120,113.28 120,110
N$95
  Top 0.305: R28.1 117.77,114.77 104,101 97.93,101 IC1.16
N$96
  Top 0.305: R30.1 115.61,118.61 101,104 98.39,104 IC1.17
N$97
  Top 0.305: R32.1 113.45,121.6 IC1.18
N$98
  Top 0.305: R34.1 110.29,132.29 86,108 84.61,108 IC1.23
N$99
  Top 0.305: R36.1 107.13,140.13 80,113 80,105.93 IC1.24
N$100
  Bottom 0.305: R38.1 101.37,112.06 IC1.19
N$101
  Bottom 0.305: R40.1 96.37,112.42 IC1.20
N$102
  Bottom 0.305: R42.1 91.37,119.84 IC1.21
N$103
  Bottom 0.305: R44.1 86.37,123.37 80,117 80,110 81.53,108.47 IC1.22
N$104
  Top 0.305: R46.1 78,136.4 78,98 80.23,95.77 IC1.27
N$105
  Top 0.305: R48.1 76,139.24 76,94 76.77,93.23 IC1.28
N$106
  Bottom 0.61: Q1.A 37.1,40.2 38.62,42.63 38.69,44.79 R51.2 37.91,67 | 37.91,67 38,67 | 37.91,67 34,67 31,64 21.55,64 IC3.2
N$107
  Top 0.61: IC3.6 21.23,79.15 R50.2
N$108  (via drill 0.35)
  Top 0.3: v92,77 92,78 94,80 97.25,80 IC1.8
  Bottom 0.3: R50.1 59.63,79.37 65,74 65,63 67.5,60.5 87.5,60.5 92,65 v92,77
N$109
  Top 0.61: R52.2 39.83,69.17 47,62 47,49.33 R53.3
  Bottom 0.61: IC3.3 21.23,68.77 23,66 29.46,66 R52.2
N$110
  Top 0.152: R54.1 98.06,75.73 IC1.6

### Text on the board
tNames: Wireless POV Display / By Fernando Zigunov ©2017